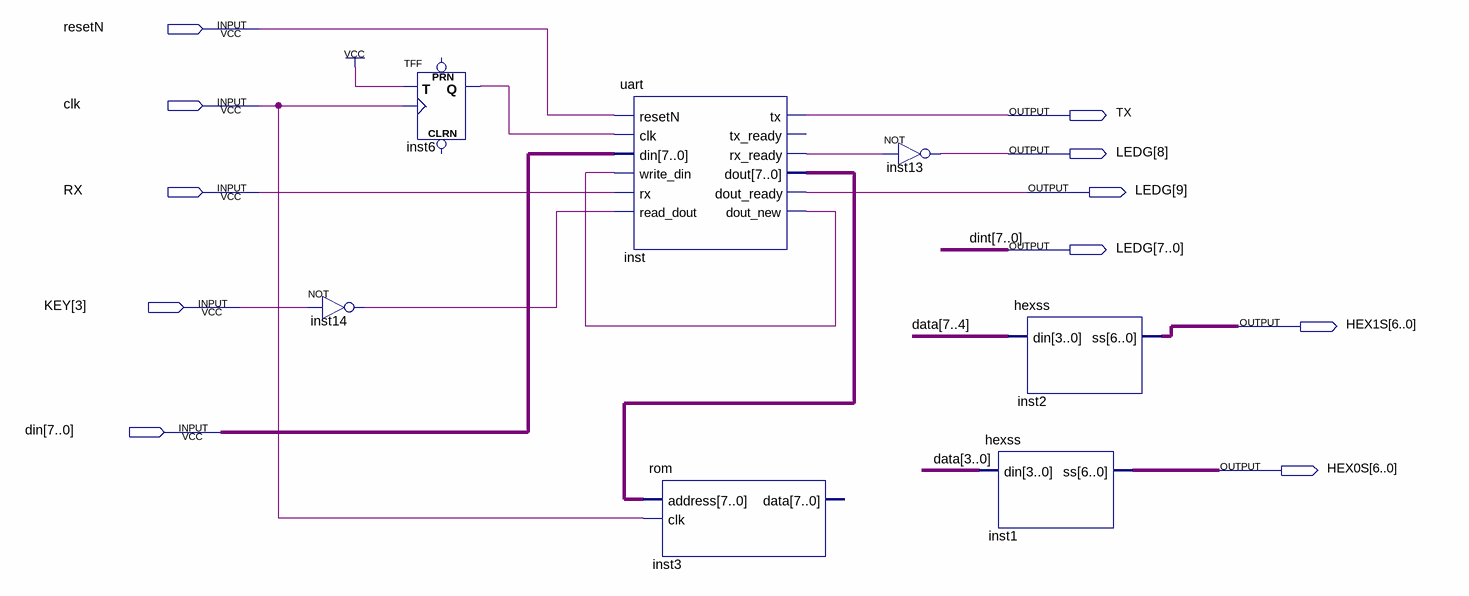
[diagram p0: schematic sheet]
// Quartus schematic test_uart.bdf as structural Verilog: 7 symbols, 11 pins
module test_uart (
  input  resetN,
  input  clk,
  input  RX,
  input  [3:3] KEY,
  input  [7:0] din,
  output TX,
  output [9:0] LEDG,
  output [6:0] HEX1S,
  output [6:0] HEX0S
);

  wire inst6_q, inst14_out, inst_dout_new, inst_rx_ready;
  wire [7:0] data, inst_dout;

  not inst14 (inst14_out, KEY[3]);
  TFF inst6 (.T(1'b1), .CLK(clk), .Q(inst6_q));  // open: PRN, CLRN
  uart inst (
    .resetN(resetN), .clk(inst6_q), .din(din), .write_din(inst_dout_new), .rx(RX), .read_dout(inst14_out),
    .tx(TX), .rx_ready(inst_rx_ready), .dout(inst_dout), .dout_ready(LEDG[9]), .dout_new(inst_dout_new));  // open: tx_ready
  rom inst3 (.address(inst_dout), .clk(clk));  // open: data
  not inst13 (LEDG[8], inst_rx_ready);
  hexss inst2 (.din(data[7:4]), .ss(HEX1S));
  hexss inst1 (.din(data[3:0]), .ss(HEX0S));

  // Other names for the same wires on the sheet: dint[7:0] = LEDG[7:0]
endmodule
